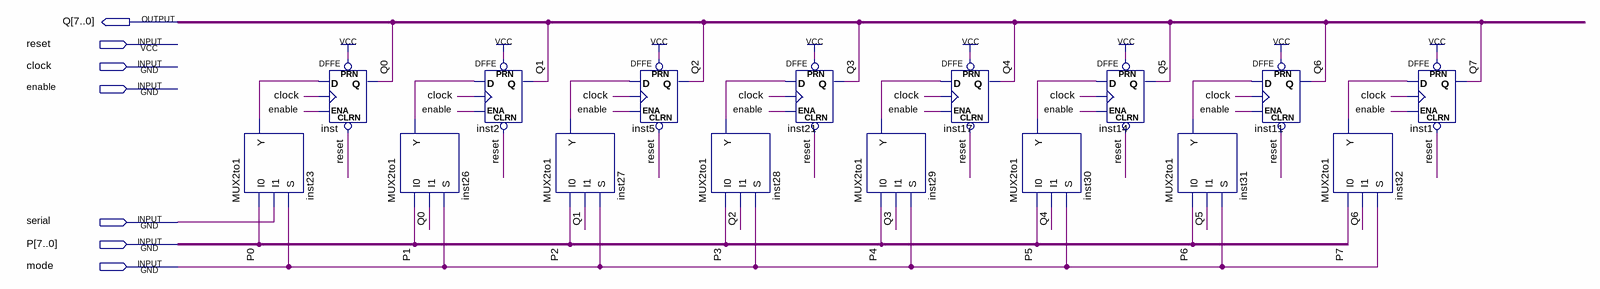
[diagram p0: schematic sheet]
// Quartus schematic SHREG8bit.bdf as structural Verilog: 16 symbols, 7 pins
module SHREG8bit (
  input  reset,
  input  clock,
  input  enable,
  input  serial,
  input  [7:0] P,
  input  mode,
  output [7:0] Q
);

  wire inst23_y, inst26_y, inst27_y, inst28_y, inst29_y, inst30_y, inst31_y, inst32_y;

  MUX2to1 inst23 (.I0(P[0]), .I1(serial), .S(mode), .Y(inst23_y));
  DFFE inst (.PRN(1'b1), .CLRN(reset), .D(inst23_y), .CLK(clock), .ENA(enable), .Q(Q[0]));
  MUX2to1 inst26 (.I0(P[1]), .I1(Q[0]), .S(mode), .Y(inst26_y));
  DFFE inst2 (.PRN(1'b1), .CLRN(reset), .D(inst26_y), .CLK(clock), .ENA(enable), .Q(Q[1]));
  MUX2to1 inst27 (.I0(P[2]), .I1(Q[1]), .S(mode), .Y(inst27_y));
  DFFE inst5 (.PRN(1'b1), .CLRN(reset), .D(inst27_y), .CLK(clock), .ENA(enable), .Q(Q[2]));
  MUX2to1 inst28 (.I0(P[3]), .I1(Q[2]), .S(mode), .Y(inst28_y));
  DFFE inst21 (.PRN(1'b1), .CLRN(reset), .D(inst28_y), .CLK(clock), .ENA(enable), .Q(Q[3]));
  MUX2to1 inst29 (.I0(P[4]), .I1(Q[3]), .S(mode), .Y(inst29_y));
  DFFE inst17 (.PRN(1'b1), .CLRN(reset), .D(inst29_y), .CLK(clock), .ENA(enable), .Q(Q[4]));
  MUX2to1 inst30 (.I0(P[5]), .I1(Q[4]), .S(mode), .Y(inst30_y));
  DFFE inst14 (.PRN(1'b1), .CLRN(reset), .D(inst30_y), .CLK(clock), .ENA(enable), .Q(Q[5]));
  MUX2to1 inst31 (.I0(P[6]), .I1(Q[5]), .S(mode), .Y(inst31_y));
  DFFE inst11 (.PRN(1'b1), .CLRN(reset), .D(inst31_y), .CLK(clock), .ENA(enable), .Q(Q[6]));
  MUX2to1 inst32 (.I0(P[7]), .I1(Q[6]), .S(mode), .Y(inst32_y));
  DFFE inst1 (.PRN(1'b1), .CLRN(reset), .D(inst32_y), .CLK(clock), .ENA(enable), .Q(Q[7]));
endmodule
